# EAGLE design LEDs_in_top (EAGLE 9.1.0)
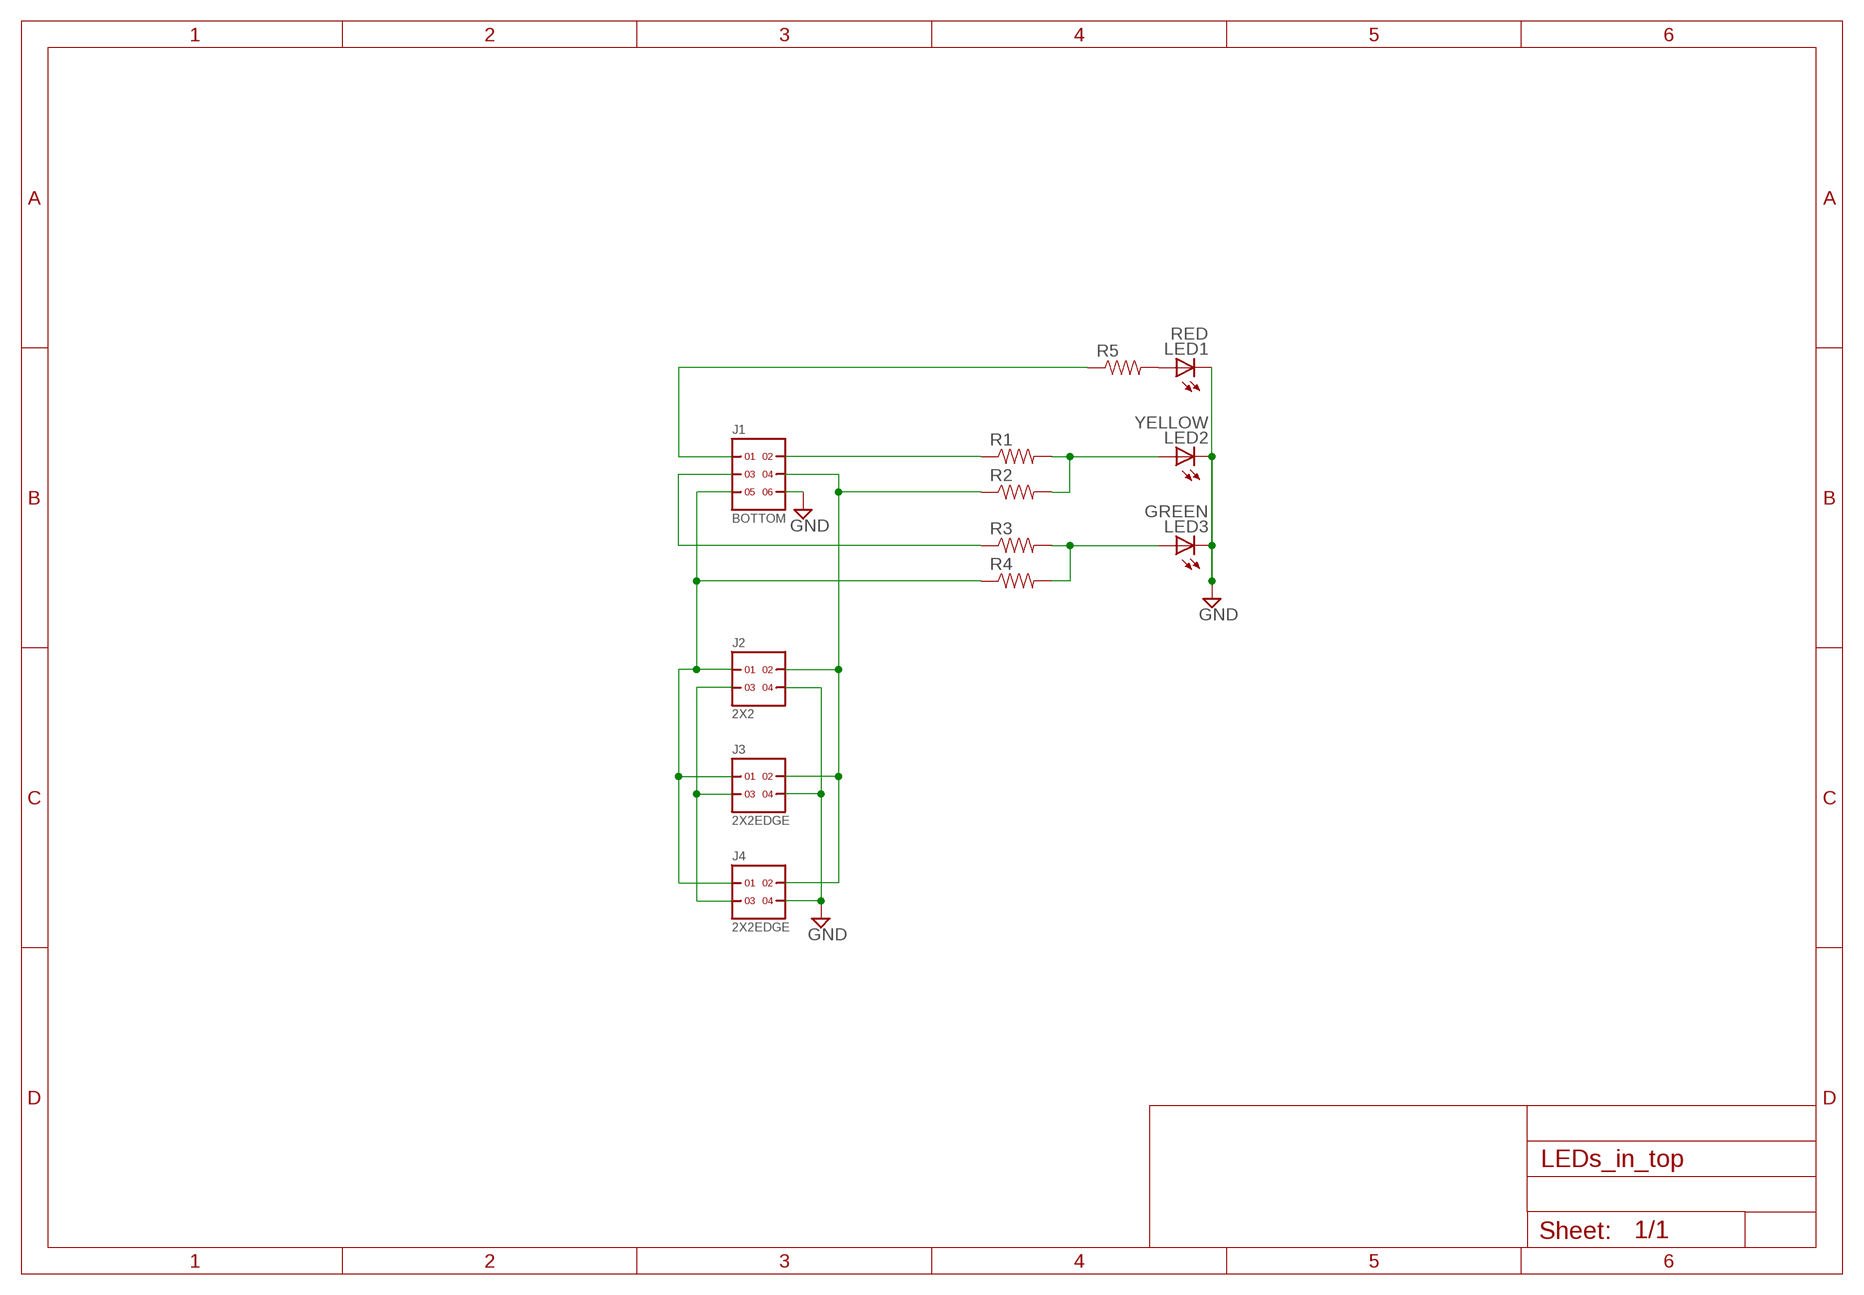
[diagram p0: schematic, sheet 1]

## Parts
J1  BOTTOM  2X3EDGE  [2X3-2MM-EDGE]
J2  2X2  [2X2_MMT.103.01.X.DH]
J3  2X2EDGE  [2X2-2MM-EDGE]
J4  2X2EDGE  [2X2-2MM-EDGE]
LED1  RED  LEDCHIP-LED0805  [CHIP-LED0805]
LED2  YELLOW  LEDCHIP-LED0805  [CHIP-LED0805]
LED3  GREEN  LEDCHIP-LED0805  [CHIP-LED0805]
R1  RESISTOR0805-RES  [0805]
R2  RESISTOR0805-RES  [0805]
R3  RESISTOR0805-RES  [0805]
R4  RESISTOR0805-RES  [0805]
R5  RESISTOR0805-RES  [0805]

## Nets
GND: J1.6 J2.4 J3.4 J4.4 LED1.C LED2.C LED3.C
GREEN: J1.3 R3.1
MG: J1.5 J2.1 J3.1 J4.1 R4.1
MR: J1.4 J2.2 J3.2 J4.2 R2.1
N$2: LED3.A R3.2 R4.2
N$7: J2.3 J3.3 J4.3
N$9: LED2.A R1.2 R2.2
N$10: LED1.A R5.2
RED: J1.1 R5.1
YELLOW: J1.2 R1.1

## Library data of the parts
J1 = connectors:2X3
J2-J4 = connectors:2X2
LED1-LED3 = led:LED: LED OSRAM: - CHIPLED LG R971, LG N971, LY N971, LG Q971, LY Q971, LO R971, LY R971 LH N974, LH R974 LS Q976, LO Q976, LY Q976 LO Q996 - Hyper CHIPLED LW Q18S LB Q993, LB Q99A, LB R99A - SideLED LS A670, LO A670, LY A670, LG A670, LP A670 LB A673, LV A673, LT A673, LW A673 LH A674 LY A675 LS A676, LA A676, LO A676, LY A676, LW A676 LS A679, LY A679, LG A679 - Hyper Micro SIDELED® LS Y876, LA Y876, LO Y876, LY Y876 LT Y87S - SmartLED LW L88C, LW L88S LB L89C, LB L89S, LG L890 LS L89K, LO L89K, LY L89K LS L896, LA L896, LO L896, LY L896 - TOPLED LS T670, LO T670, LY T670, LG T670, LP T670 LSG T670, LSP T670, LSY T670, LOP T670, LYG T670 LG T671, LOG T671, LSG T671 LB T673, LV T673, LT T673, LW T673 LH T674 LS T676, LA T676, LO T676, LY T676, LB T676, LH T676, LSB T676, LW T676 LB T67C, LV T67C, LT T67C, LS T67K, LO T67K, LY T67K, LW E67C LS E67B, LA E67B, LO E67B, LY E67B, LB E67C, LV E67C, LT E67C LW T67C LS T679, LY T679, LG T679 LS T770, LO T770, LY T770, LG T770, LP T770 LB T773, LV T773, LT T773, LW T773 LH T774 LS E675, LA E675, LY E675, LS T675 LS T776, LA T776, LO T776, LY T776, LB T776 LHGB T686 LT T68C, LB T68C - Hyper Mini TOPLED® LB M676 - Mini TOPLED Santana® LG M470 LS M47K, LO M47K, LY M47K Source: http://www.osram.convergy.de LUXEON: - LUMILED® LXK2-PW12-R00, LXK2-PW12-S00, LXK2-PW14-U00, LXK2-PW14-V00 LXK2-PM12-R00, LXK2-PM12-S00, LXK2-PM14-U00 LXK2-PE12-Q00, LXK2-PE12-R00, LXK2-PE12-S00, LXK2-PE14-T00, LXK2-PE14-U00 LXK2-PB12-K00, LXK2-PB12-L00, LXK2-PB12-M00, LXK2-PB14-N00, LXK2-PB14-P00, LXK2-PB14-Q00 LXK2-PR12-L00, LXK2-PR12-M00, LXK2-PR14-Q00, LXK2-PR14-R00 LXK2-PD12-Q00, LXK2-PD12-R00, LXK2-PD12-S00 LXK2-PH12-R00, LXK2-PH12-S00 LXK2-PL12-P00, LXK2-PL12-Q00, LXK2-PL12-R00 Source: www.luxeon.com KINGBRIGHT: KA-3528ASYC Source: www.kingbright.com
R1-R5 = SparkFun-Passives:RESISTOR: Resistor Basic schematic elements and footprints for 0603, 1206, and PTH resistors.

## Board
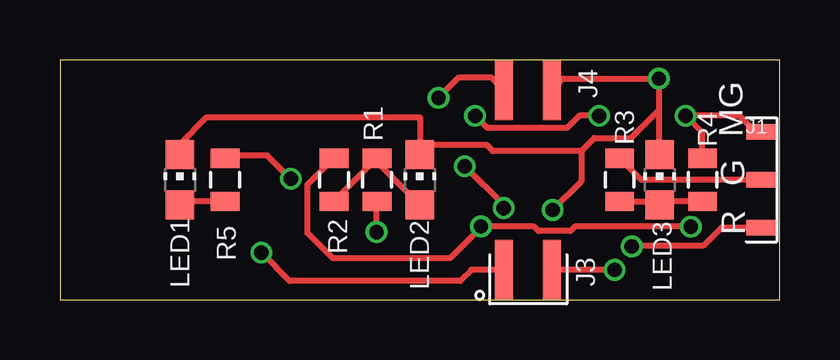
[diagram p1: board, top side]
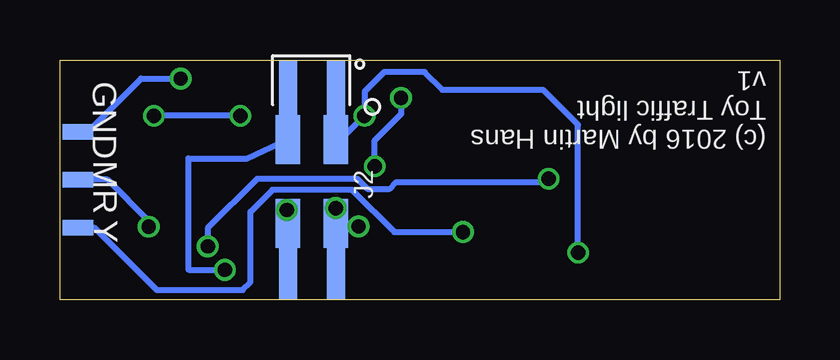
[diagram p2: board, bottom side, seen from below]

Size 30 x 10 mm. Coordinates in mm from the lower left corner, seen from the top.
Outline: 30,10 0,10 0,0 30,0 30,10
Copper layers (1*16): Top 0.035mm / dielectric 1.5mm / Bottom 0.035mm
Design rules "SeeedStudio_2layer_DRU_no_angle_20140221": minimum track width 6mil, minimum drill 12mil, track to track 6mil, track to pad 6mil, pad to pad 6mil, via to via 6mil, smd to smd 0mil, copper to edge 10mil, drill to drill 10mil, minimum pad ring 10mil, minimum via ring 6mil, stop-mask expansion 2mil, vias tented up to drill 100mil, thermal gap 10mil

### Footprints (pad centres in the part's own frame; a part is rotated, then mirrored left to right if it is on the bottom)
2X3-2MM-EDGE = smd 1.27 x 0.635: 1 0,2; 3 0,0; 5 0,-2 | smd 1.27 x 0.635 bottom: 2 0,2; 4 0,0; 6 0,-2
2X2_MMT.103.01.X.DH = smd 1.016 x 2.032: 1 -2,-1.68; 2 -2,1.825; 3 0,-1.68; 4 0,1.825
2X2-2MM-EDGE = smd 2.5 x 0.75: 1 0,2; 3 0,0 | smd 2.5 x 0.75 bottom: 2 0,2; 4 0,0
CHIP-LED0805 = smd 1.2 x 1.2: A 0,-1.05; C 0,1.05
0805 = smd 0.8 x 1.2: 1 -0.9,0; 2 0.9,0

### Placement (x,y rotation side)
J1  29.24,5 180 top
J2  20.5,5 180 bottom
J3  20.5,1.25 90 top
J4  20.5,8.75 270 bottom
LED1  5,5 0 top
LED2  15,5 0 top
LED3  25,5 0 top
R1  13.21,5 90 top
R2  11.43,5 270 top
R3  23.33,5 270 top
R4  26.79,5 270 top
R5  6.89,5 270 top

### Tracks (layer width: path | path; a pad name or v marks a point on that pad's centre or on a via)
GND  (via drill 0.6, 0.6 pad 0.3)
  Top 0.254: 24.97,7.9 v24.97,9.22 20.97,9.22 J4.4 20.52,9.43 20.52,8.66 20.24,8.38 | 24.97,7.9 24.97,6.16 LED3.C | 15.06,6.2 LED2.C | LED1.C 5,6.5 6.09,7.59 15.01,7.59 15.02,7.58 15.02,6.07 LED2.C | 21.73,6.2 22.28,6.74 23.81,6.74 24.97,7.9 | 21.73,6.2 21.73,4.93 v20.54,3.74 | 21.73,6.2 18.05,6.2 17.8,6.44 15.39,6.44 LED2.C
  Bottom 0.254: 29,7 29,6.84 26.62,9.22 v24.97,9.22 | J3.4 J2.4 20.54,3.21 v20.54,3.74
  Bottom 0.653: J1.6 29,7
GREEN
  Top 0.254: 23.33,5.98 R3.1 24.23,5 29,5
  Top 0.653: J1.3 29,5
MG  (via drill 0.6, 0.6 pad 0.3)
  Top 0.254: 29,7 28.33,7.67 v26.09,7.67 26.79,6.97 R4.1 | v22.48,7.67 21.65,7.67 21.14,7.16 17.82,7.16 v17.31,7.67 | J3.1 17.15,1.25 16.68,0.78 9.58,0.78 v8.4,1.96
  Top 0.653: J1.5 29,7
  Bottom 0.254: v22.48,7.67 v26.09,7.67 26.06,7.64 | J4.1 18.83,7.24 J2.1 18.3,6.68 v17.31,7.67 v17.3,7.68 17.3,8.68 16.48,9.5 14.8,9.5 14.06,8.76 9.86,8.76 8.4,7.3 v8.4,1.96
MR  (via drill 0.6, 0.6 pad 0.3)
  Top 0.254: R2.1 10.32,4.79 10.32,2.78 11.38,1.72 16.26,1.72 17.55,3.01 v17.55,3.05 17.91,3.05 19.76,3.05 19.95,2.86 21.28,2.86 21.47,3.05 v26.29,3.05 v26.3,3.04 | v18.5,3.82 18.5,3.94 v16.88,5.56 | J4.2 17.97,9.28 16.64,9.28 v15.78,8.42
  Bottom 0.254: 29,5 28.02,5 26.3,3.29 v26.3,3.04 | J2.2 17.67,3.17 v17.55,3.05 | J3.2 J2.2 | J2.2 v18.5,3.82 | v16.88,5.56 16.88,6.64 15.78,7.74 v15.78,8.42
  Bottom 0.653: J1.4 29,5
N$2
  Top 0.254: 23.29,4.22 R3.2 24.85,4.1 LED3.A | 24.85,4.18 LED3.A | R4.2 25.15,4.1 LED3.A
N$7  (via drill 0.6)
  Top 0.254: J3.3 v23.12,1.24
  Bottom 0.254: J4.3 J2.3 22.18,5.89 24.64,5.89 24.64,1.25 v23.13,1.25 v23.12,1.24
N$9
  Top 0.254: 14.85,4.1 LED2.A 13.21,5.74 R1.2 11.43,4.11 R2.2
N$10
  Top 0.254: 5.15,4.18 LED1.A 5.15,4.1 R5.2
RED  (via drill 0.6)
  Top 0.254: R5.1 6.93,6.02 8.64,6.02 v9.62,5.04 | 29,3 27.58,3 26.82,2.24 23.86,2.24 v23.84,2.22
  Top 0.653: J1.1 29,3
  Bottom 0.254: 23.84,2.66 v23.84,2.22 23.84,2.98 21.78,5.04 17.6,5.04 17.18,4.62 16.26,4.62 15.98,4.9 9.76,4.9 v9.62,5.04
YELLOW  (via drill 0.6)
  Top 0.254: v13.2,2.82 13.2,4.08 R1.1
  Bottom 0.254: 29,3 28.56,3 25.96,0.4 22.38,0.4 22.06,0.72 22.06,3.66 21.14,4.58 17.82,4.58 16.06,2.82 v13.2,2.82
  Bottom 0.653: J1.2 29,3

### Text on the board
tNames: MG | G | R
bNames: (c) 2016 by Martin Hans / Toy Traffic light / v1 | GND | MR | Y